# Altium schematic sheet ShuttleBoard.SchDoc
size A3; SheetNumber: 1; SheetTotal: 1
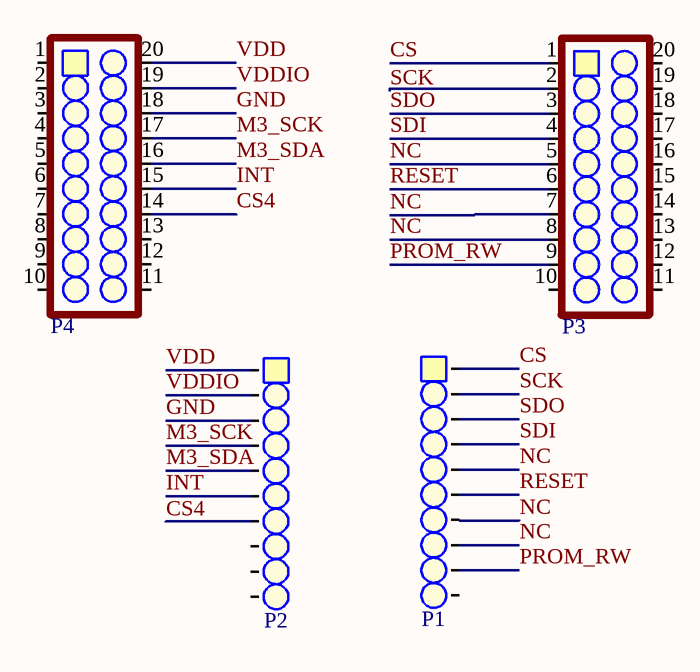
[diagram p0: ShuttleBoard.SchDoc]

## Parts
P1  1x10 Pin Header  [1x10HEADER]  (value not drawn)
P2  1x10 Pin Header  [1x10HEADER]  (value not drawn)
P3  2x10 Pin Header  [SOP20]  (value not drawn)
P4  2x10 Pin Header  [SOP20]  (value not drawn)

## Nets
CS: P1.1 P3.1
CS4: P2.7 P4.14
GND: P2.3 P4.18
INT: P2.6 P4.15
M3_SCK: P2.4 P4.17
M3_SDA: P2.5 P4.16
NC: P1.5 P1.7 P1.8 P3.5 P3.7 P3.8
PROM_RW: P1.9 P3.9
RESET: P1.6 P3.6
SCK: P1.2 P3.2
SDI: P1.4 P3.4
SDO: P1.3 P3.3
VDD: P2.1 P4.20
VDDIO: P2.2 P4.19

Not connected (* = marked no-connect by the designer): P1 10; P2 8 9 10; P3 10(0) 11 12 13 14 15 16 17 18 19 20; P4 1 2 3 4 5 6 7 8 9 10(0) 11 12 13

## Library data of the parts
P1 P2 = 1x10 Pin Header: 2.54 mm, TH; Value: 1x2 Pin Header
P3 P4 = 2x10 Pin Header: 1.27 mm